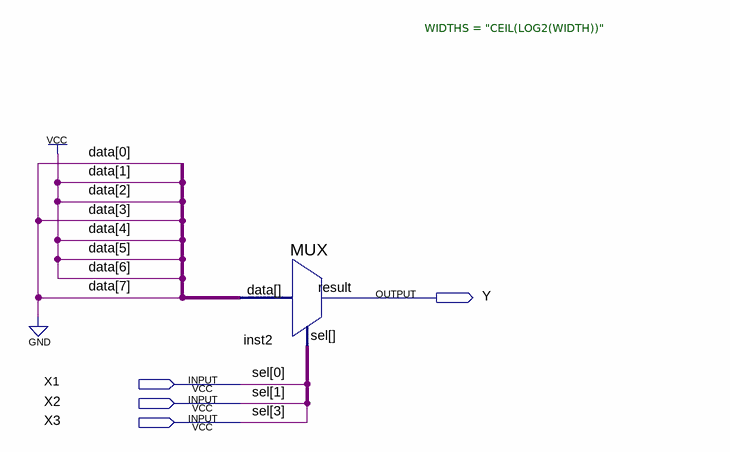
[diagram p0: schematic sheet]
// Quartus schematic dop3.bdf as structural Verilog: 1 symbols, 4 pins
module dop3 (
  input  X1,
  input  X2,
  input  X3,
  output Y
);

  wire undriven, undriven_2;

  MUX #(.WIDTHS("CEIL(LOG2(WIDTH))")) inst2 (.data(undriven_2), .sel(undriven), .result(Y));

  // Other names for the same wires on the sheet: sel (some bits) = {X3, X2, X1}
endmodule
